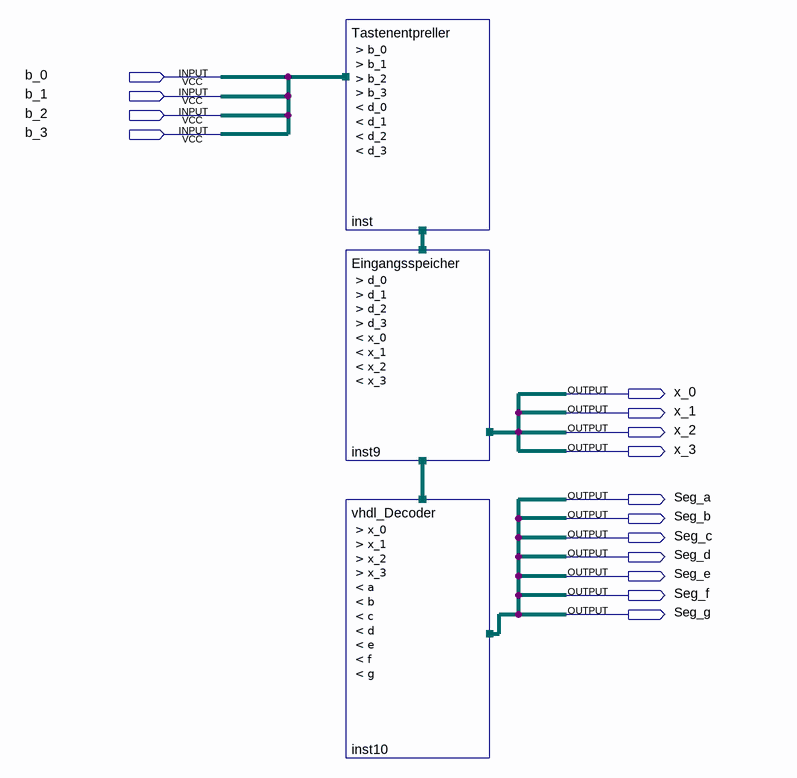
[diagram p0: schematic sheet]
// Quartus schematic Seven_Seg_System_vhdl_template.bdf as structural Verilog: 3 symbols, 15 pins
module Seven_Seg_System_vhdl_template (
  input  b_0,
  input  b_1,
  input  b_2,
  input  b_3,
  output x_0,
  output x_1,
  output x_2,
  output x_3,
  output Seg_a,
  output Seg_b,
  output Seg_c,
  output Seg_d,
  output Seg_e,
  output Seg_f,
  output Seg_g
);

  wire d_0, d_1, d_2, d_3;

  Tastenentpreller inst (.b_0(b_0), .b_1(b_1), .b_2(b_2), .b_3(b_3), .d_0(d_0), .d_1(d_1), .d_2(d_2), .d_3(d_3));
  Eingangsspeicher inst9 (.d_0(d_0), .d_1(d_1), .d_2(d_2), .d_3(d_3), .x_0(x_0), .x_1(x_1), .x_2(x_2), .x_3(x_3));
  vhdl_Decoder inst10 (
    .x_0(x_0), .x_1(x_1), .x_2(x_2), .x_3(x_3), .a(Seg_a), .b(Seg_b), .c(Seg_c), .d(Seg_d), .e(Seg_e),
    .f(Seg_f), .g(Seg_g));
endmodule
